# EAGLE design bb8-audio (EAGLE 7.5.0)
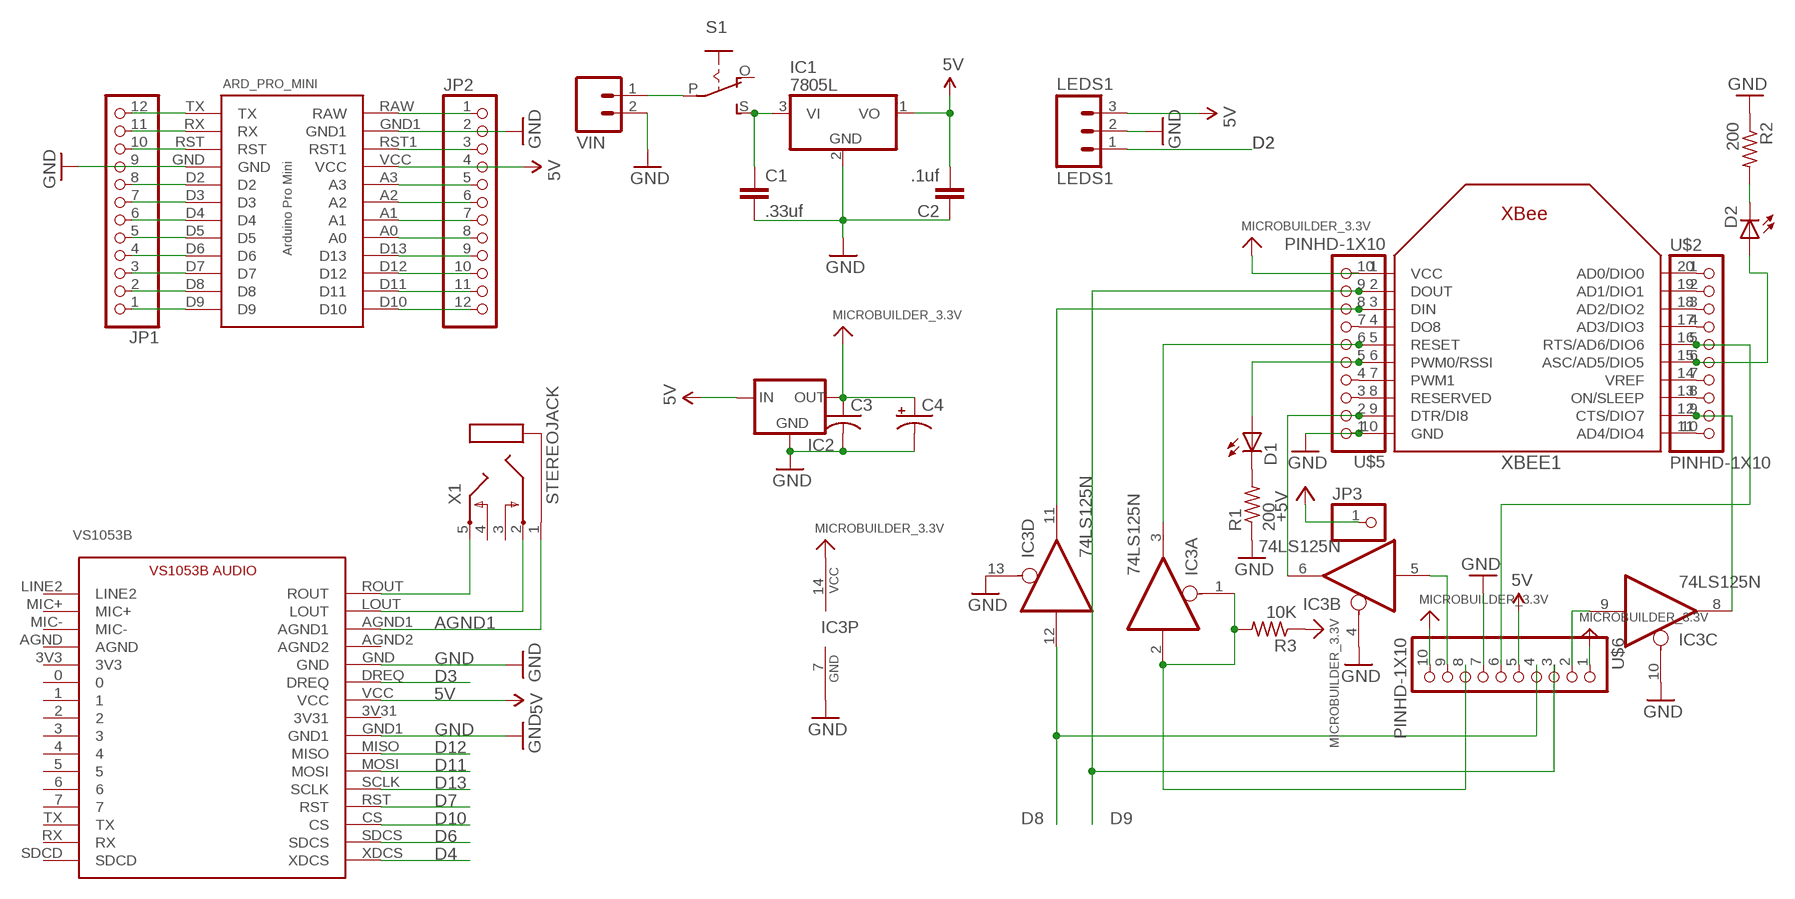
[diagram p0: schematic, sheet 1]

## Parts
ARD_PRO_MINI  ARD_PRO_MINI  [ARD_PRO_MINI]
C1  .33uf  CAPEZ  [CAP-PTH-SMALLEZ]
C2  .1uf  CAPEZ  [CAP-PTH-SMALLEZ]
C3  C-US025-025X050  [C025-025X050]
C4  CPOL-USE2.5-5  [E2,5-5]
D1  LED3MM  [LED3MM]
D2  LED3MM  [LED3MM]
IC1  7805L  [TO92]
IC2  MC1700  [TO92]
IC3  74LS125N  [DIL14]
JP1  PINHD-1X12-CB  [1X12-CB]
JP2  PINHD-1X12-CB  [1X12-CB]
JP3  PINHD-1X1  [1X01]
LEDS1  LEDS1  M03PTH  [1X03]
R1  200  R-US_0207/10  [0207/10]
R2  200  R-US_0207/10  [0207/10]
R3  10K  R-US_0207/10  [0207/10]
S1  EG1218S  [EG1218]
U$2  PINHD-1X10  [1X10-BIG]
U$5  PINHD-1X10  [1X10-BIG]
U$6  PINHD-1X10  [1X10-BIG]
VIN  M02PTH  [1X02]
VS1053B  VS1053B_BREAKOUT  [VS1053_BREAKOUT]
X1  STEREOJACK  [STX3100]
XBEE1  XBEE  [XBEE]

## Nets
3.3V: C3.1 C4.+ IC2.3(OUT) IC3.14(P:VCC) R3.1 U$5.10 U$6.1 U$6.10 XBEE1.1(VCC) ; supply symbol labelled MICROBUILDER_3.3V
5V: ARD_PRO_MINI.VCC C2.2 IC1.1(VO) IC2.2(IN) JP2.4 LEDS1.3 U$6.5 VS1053B.VCC
+5V: JP3.1
A0: ARD_PRO_MINI.A0 JP2.8
A1: ARD_PRO_MINI.A1 JP2.7
A2: ARD_PRO_MINI.A2 JP2.6
A3: ARD_PRO_MINI.A3 JP2.5
AGND1: VS1053B.AGND1 X1.1
D2: ARD_PRO_MINI.D2 JP1.8 LEDS1.1
D3: ARD_PRO_MINI.D3 JP1.7 VS1053B.DREQ
D4: ARD_PRO_MINI.D4 JP1.6 VS1053B.XDCS
D5: ARD_PRO_MINI.D5 JP1.5
D6: ARD_PRO_MINI.D6 JP1.4 VS1053B.SDCS
D7: ARD_PRO_MINI.D7 JP1.3 VS1053B.RST
D8: ARD_PRO_MINI.D8 IC3.12(D:I) JP1.2 U$6.4
D9: ARD_PRO_MINI.D9 JP1.1 U$5.9 U$6.3 XBEE1.2(DOUT)
D10: ARD_PRO_MINI.D10 JP2.12 VS1053B.CS
D11: ARD_PRO_MINI.D11 JP2.11 VS1053B.MOSI
D12: ARD_PRO_MINI.D12 JP2.10 VS1053B.MISO
D13: ARD_PRO_MINI.D13 JP2.9 VS1053B.SCLK
GND: ARD_PRO_MINI.GND ARD_PRO_MINI.GND1 C1.2 C2.1 C3.2 C4.- IC1.2(GND) IC2.1(GND) IC3.4(B:OE) IC3.7(P:GND) IC3.10(C:OE) IC3.13(D:OE) JP1.9 JP2.2 LEDS1.2 R1.1 R2.1 U$5.1 U$6.7 VIN.2 VS1053B.GND VS1053B.GND1 XBEE1.10(GND)
N$2: C1.1 IC1.3(VI) S1.S
N$4: IC3.11(D:O) U$5.8 XBEE1.3(DIN)
N$5: IC3.8(C:O) U$2.9 XBEE1.12(CTS/DIO7)
N$6: U$5.7 XBEE1.4(DO8)
N$7: D1.A U$5.5 XBEE1.6(PWM0/RSSI)
N$8: D1.K(C) R1.2
N$9: D2.K(C) R2.2
N$10: D2.A U$2.6 XBEE1.15(ASC/AD5/DIO5)
N$11: IC3.6(B:O) U$5.2 XBEE1.9(DTR/DI8)
N$12: U$5.3 XBEE1.8(RESERVED)
N$13: U$5.4 XBEE1.7(PWM1)
N$14: U$2.1 XBEE1.20(AD0/DIO0)
N$15: U$2.2 XBEE1.19(AD1/DIO1)
N$16: U$2.3 XBEE1.18(AD2/DIO2)
N$17: U$2.4 XBEE1.17(AD3/DIO3)
N$18: U$2.7 XBEE1.14(VREF)
N$19: U$2.8 XBEE1.13(ON/SLEEP)
N$20: U$2.10 XBEE1.11(AD4/DIO4)
N$21: VS1053B.LOUT X1.2
N$22: IC3.9(C:I) U$6.2
N$23: IC3.3(A:O) U$5.6 XBEE1.5(RESET)
N$24: IC3.5(B:I) U$6.9
N$25: VS1053B.ROUT X1.5
N$26: S1.P VIN.1
RAW: ARD_PRO_MINI.RAW JP2.1
RESET: IC3.1(A:OE) IC3.2(A:I) R3.2 U$6.8
RST: ARD_PRO_MINI.RST ARD_PRO_MINI.RST1 JP1.10 JP2.3
RTS1: U$2.5 U$6.6 XBEE1.16(RTS/AD6/DIO6)
RX: ARD_PRO_MINI.RX JP1.11
TX: ARD_PRO_MINI.TX JP1.12
Unconnected: S1.O VS1053B.0 VS1053B.1 VS1053B.2 VS1053B.3 VS1053B.3V3 VS1053B.3V31 VS1053B.4 VS1053B.5 VS1053B.6 VS1053B.7 VS1053B.AGND VS1053B.AGND2 VS1053B.LINE2 VS1053B.MIC+ VS1053B.MIC- VS1053B.RX VS1053B.SDCD VS1053B.TX X1.3 X1.4

## Library data of the parts
ARD_PRO_MINI = Arduino-Pro-Mini:ARD_PRO_MINI
C1 C2 = SparkFun-Capacitors:CAP: Capacitor Standard 0603 ceramic capacitor, and 0.1" leaded capacitor.
C3 = rcl-ez:C-US: CAPACITOR, American symbol
C4 = rcl-ez:CPOL-US: POLARIZED CAPACITOR, American symbol
D1 D2 = minimidi:LED: LED OSRAM: - CHIPLED LG R971, LG N971, LY N971, LG Q971, LY Q971, LO R971, LY R971 LH N974, LH R974 LS Q976, LO Q976, LY Q976 LO Q996 - Hyper CHIPLED LW Q18S LB Q993, LB Q99A, LB R99A - SideLED LS A670, LO A670, LY A670, LG A670, LP A670 LB A673, LV A673, LT A673, LW A673 LH A674 LY A675 LS A676, LA A676, LO A676, LY A676, LW A676 LS A679, LY A679, LG A679 - Hyper Micro SIDELED® LS Y876, LA Y876, LO Y876, LY Y876 LT Y87S - SmartLED LW L88C, LW L88S LB L89C, LB L89S, LG L890 LS L89K, LO L89K, LY L89K LS L896, LA L896, LO L896, LY L896 - TOPLED LS T670, LO T670, LY T670, LG T670, LP T670 LSG T670, LSP T670, LSY T670, LOP T670, LYG T670 LG T671, LOG T671, LSG T671 LB T673, LV T673, LT T673, LW T673 LH T674 LS T676, LA T676, LO T676, LY T676, LB T676, LH T676, LSB T676, LW T676 LB T67C, LV T67C, LT T67C, LS T67K, LO T67K, LY T67K, LW E67C LS E67B, LA E67B, LO E67B, LY E67B, LB E67C, LV E67C, LT E67C LW T67C LS T679, LY T679, LG T679 LS T770, LO T770, LY T770, LG T770, LP T770 LB T773, LV T773, LT T773, LW T773 LH T774 LS E675, LA E675, LY E675, LS T675 LS T776, LA T776, LO T776, LY T776, LB T776 LHGB T686 LT T68C, LB T68C - Hyper Mini TOPLED® LB M676 - Mini TOPLED Santana® LG M470 LS M47K, LO M47K, LY M47K Source: http://www.osram.convergy.de/
IC1 = linear:78*: Positive VOLTAGE REGULATOR Source: http://cache.national.com/ds/LM/LM78L05.pdf http://www.fairchildsemi.com/ds/LM/LM7805.pdf
IC2 = ulink:MC1700: VOLTAGE REGULATOR
IC3 = 74xx-us:74*125: Quad bus BUFFER, 3-state
JP1 JP2 = adafruit:PINHD-1X12: PIN HEADER
JP3 = digg:PINHD-1X1: PIN HEADER
LEDS1 = SparkFun-Connectors:M03: Header 3 Standard 3-pin 0.1" header. Use with straight break away headers (SKU : PRT-00116), right angle break away headers (PRT-00553), swiss pins (PRT-00743), machine pins (PRT-00117), and female headers (PRT-00115). Molex polarized connector foot print use with SKU : PRT-08232 with associated crimp pins and housings.
R1-R3 = rcl-ez:R-US_: RESISTOR, American symbol
S1 = adafruit:EG1218: SLIDING SWITCH 0.1" spacing through hole, vertical SPDT slide switch http://www.ladyada.net/library/pcb/eaglelibrary.html
U$2 U$5 U$6 = ybox2:PINHD-1X10
VIN = SparkFun-Connectors:M02: Header 2 Standard 2-pin 0.1" header. Use with straight break away headers (SKU : PRT-00116), right angle break away headers (PRT-00553), swiss pins (PRT-00743), machine pins (PRT-00117), and female headers (PRT-00115). Molex polarized connector foot print use with SKU : PRT-08233 with associated crimp pins and housings.
VS1053B = VS1053B_BREAKOUT:VS1053B_BREAKOUT: This is a footprint for a breakout board from Adafruit the VS1053B Audio breakout board. This package will let you easily add this breakout board to your own project for stacking the breakout onto headers for your own project.
X1 = adafruit:STEREOJACK: MIC/HEADPHONE JACK Stereo jack with two switches. Kycon STX3100, CUI SJ1-3555NG and/or 4UCon 05544
XBEE1 = ulink:XBEE

## Board
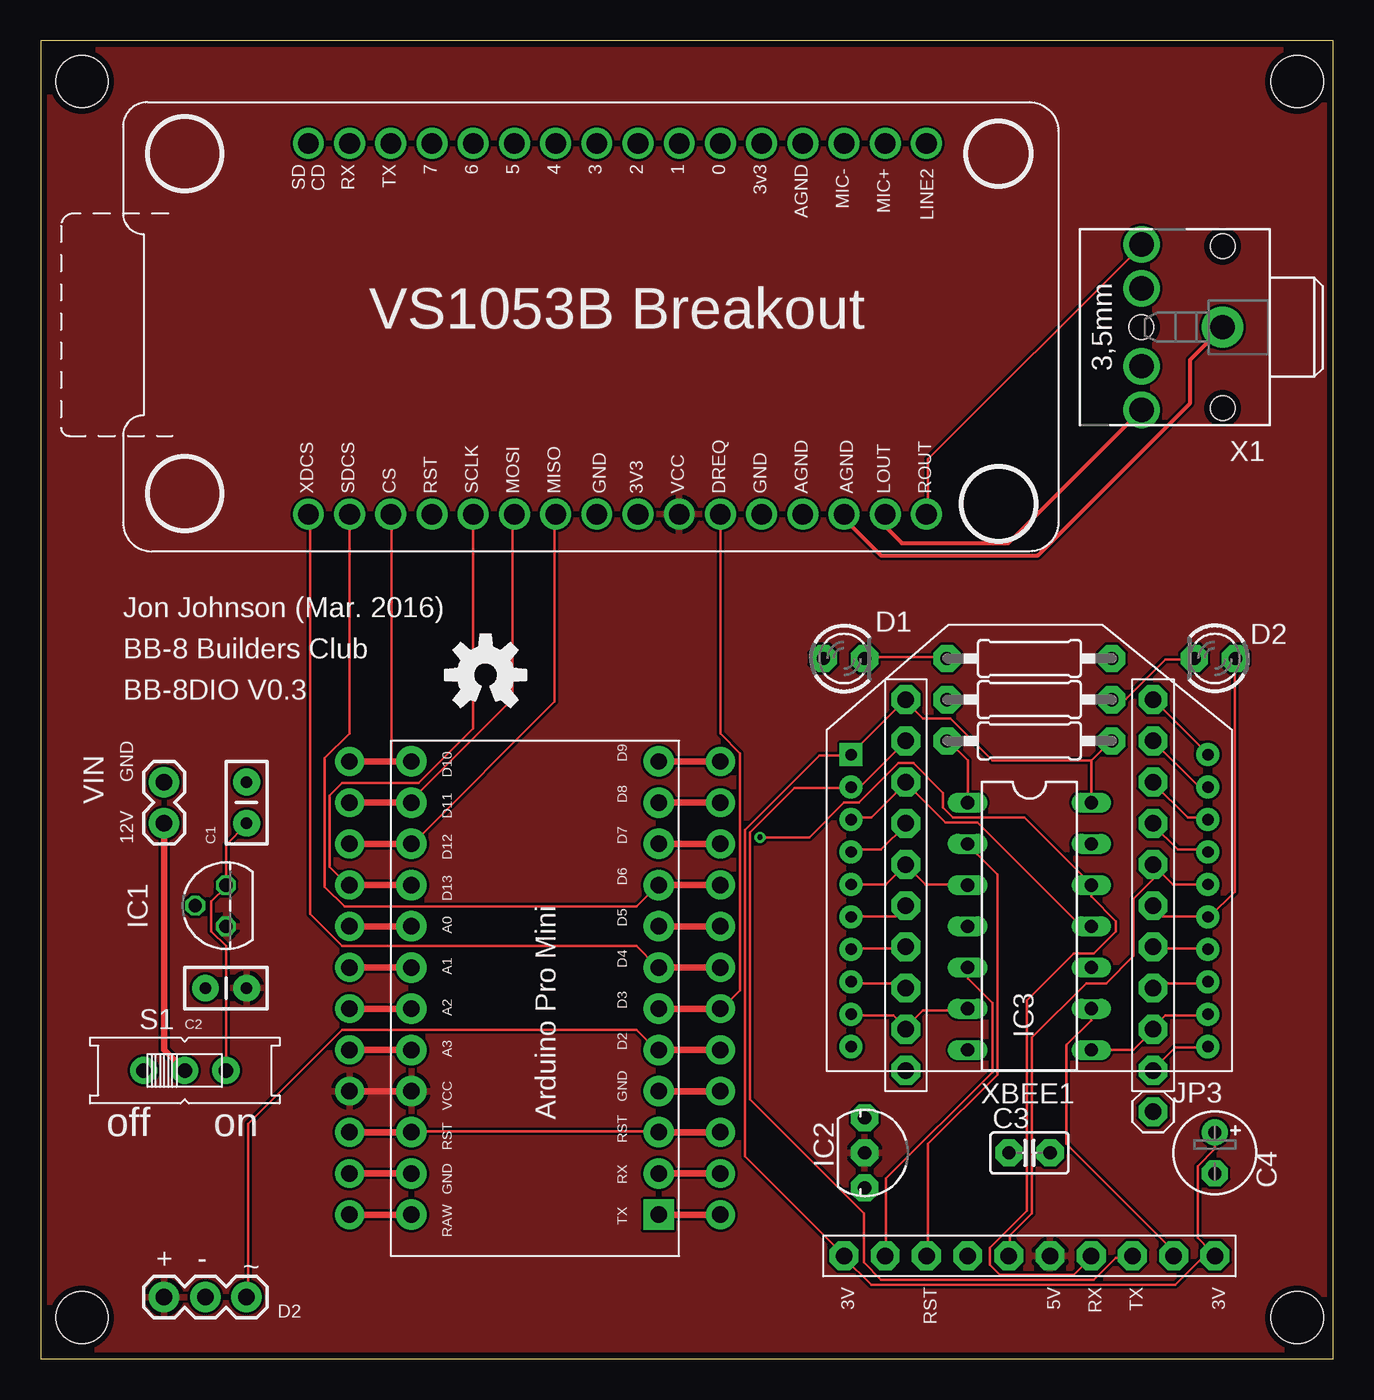
[diagram p1: board, top side]
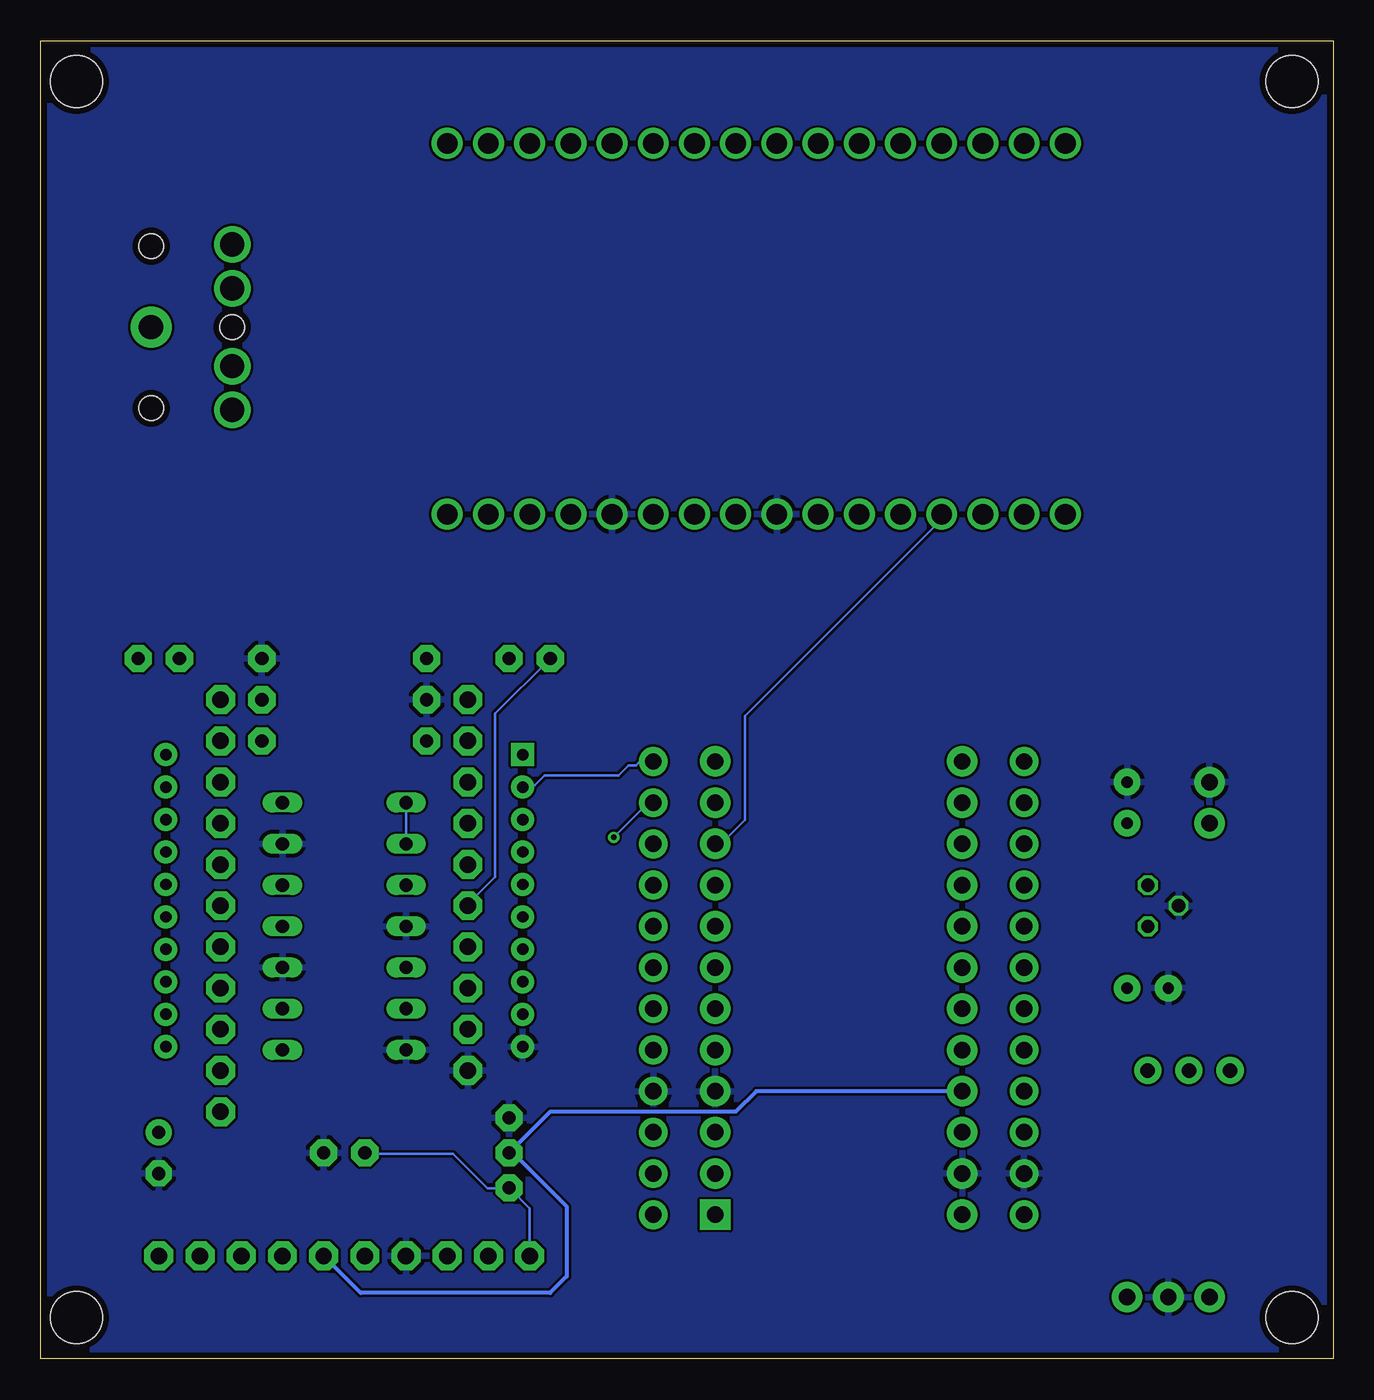
[diagram p2: board, bottom side, seen from below]

Size 79.68 x 81.27 mm. Coordinates in mm from the lower left corner, seen from the top.
Outline: 0,0 79.68,0 79.68,81.27 0,81.27 0,0
Copper layers (1*16): Top 0.0356mm / dielectric 1.5011mm / Bottom 0.0356mm
Design rules "LaenPCBOrder": minimum track width 6mil, minimum drill 13mil, track to track 6mil, track to pad 6mil, pad to pad 6mil, via to via 6mil, smd to smd 6mil, copper to edge 15mil, drill to drill 6mil, minimum pad ring 7mil, minimum via ring 7mil, stop-mask expansion 3mil, vias tented up to drill 0mil, thermal gap 10mil
Holes 3.2 mm at 2.54,78.74 2.54,2.54 77.47,2.54 77.47,78.74

### Footprints (pad centres in the part's own frame; a part is rotated, then mirrored left to right if it is on the bottom)
ARD_PRO_MINI = drill 1.016 pad 1.88: A0 7.62,-5.08; A1 7.62,-2.54; A2 7.62,0; A3 7.62,2.54; D2 -7.62,2.54; D3 -7.62,0; D4 -7.62,-2.54; D5 -7.62,-5.08; D6 -7.62,-7.62; D7 -7.62,-10.16; D8 -7.62,-12.7; D9 -7.62,-15.24; D10 7.62,-15.24; D11 7.62,-12.7; D12 7.62,-10.16; D13 7.62,-7.62; GND -7.62,5.08; GND1 7.62,10.16; RAW 7.62,12.7; RST -7.62,7.62; RST1 7.62,7.62; RX -7.62,10.16; VCC 7.62,5.08 | drill 1.016 pad 1.88 square: TX -7.62,12.7
CAP-PTH-SMALLEZ = drill 0.7 pad 1.651: 1 0,0; 2 2.54,0
C025-025X050 = drill 0.813 pad 1.676 octagon: 1 -1.27,0; 2 1.27,0
E2,5-5 = drill 0.813 pad 1.6: + -1.27,0 | drill 0.813 pad 1.6 octagon: - 1.27,0
LED3MM = drill 0.813 pad 1.676 octagon: A -1.27,0; K 1.27,0
TO92 = drill 0.813 octagon: 1 -1.27,0; 2 0,1.905; 3 1.27,0
TO92' = drill 0.813 pad 1.676 octagon: 1 -2.159,0; 2 0,0; 3 2.159,0
DIL14 = drill 0.813 long: 1 -7.62,-3.81; 2 -5.08,-3.81; 3 -2.54,-3.81; 4 0,-3.81; 5 2.54,-3.81; 6 5.08,-3.81; 7 7.62,-3.81; 8 7.62,3.81; 9 5.08,3.81; 10 2.54,3.81; 11 0,3.81; 12 -2.54,3.81; 13 -5.08,3.81; 14 -7.62,3.81
1X12-CB = drill 1.016 pad 1.778: 1 -13.97,0; 2 -11.43,0; 3 -8.89,0; 4 -6.35,0; 5 -3.81,0; 6 -1.27,0; 7 1.27,0; 8 3.81,0; 9 6.35,0; 10 8.89,0; 11 11.43,0; 12 13.97,0
1X01 = drill 1.016 pad 1.778 octagon: 1 0,0
1X03 = drill 1.016 pad 1.88: 1 0,0; 2 2.54,0; 3 5.08,0
0207/10 = drill 0.813 pad 1.676 octagon: 1 -5.08,0; 2 5.08,0
EG1218 = drill 0.9 pad 1.676: O -2.54,0; P 0,0; S 2.54,0
1X10-BIG = drill 1.016 pad 1.778 octagon: 1 -11.43,0; 2 -8.89,0; 3 -6.35,0; 4 -3.81,0; 5 -1.27,0; 6 1.27,0; 7 3.81,0; 8 6.35,0; 9 8.89,0; 10 11.43,0
1X02 = drill 1.016 pad 1.88: 1 0,0; 2 2.54,0
VS1053_BREAKOUT = drill 1.27 pad 1.88: 0 2.54,36.83; 1 2.54,34.29; 2 2.54,31.75; 3 2.54,29.21; 3V3 2.54,39.37; 3V31 25.4,31.75; 4 2.54,26.67; 5 2.54,24.13; 6 2.54,21.59; 7 2.54,19.05; AGND 2.54,41.91; AGND1 25.4,44.45; AGND2 25.4,41.91; CS 25.4,16.51; DREQ 25.4,36.83; GND 25.4,39.37; GND1 25.4,29.21; LINE2 2.54,49.53; LOUT 25.4,46.99; MIC+ 2.54,46.99; MIC- 2.54,44.45; MISO 25.4,26.67; MOSI 25.4,24.13; ROUT 25.4,49.53; RST 25.4,19.05; RX 2.54,13.97; SCLK 25.4,21.59; SDCD 2.54,11.43; SDCS 25.4,13.97; TX 2.54,16.51; VCC 25.4,34.29; XDCS 25.4,11.43
STX3100 = drill 1.5 pad 2.54: 1 2.7,-0.1 | drill 1.5: 2 7.7,5; 3 7.7,2.3; 4 7.7,-2.5; 5 7.7,-5.2 | hole 1.5: 2.7,4.9; 2.7,-5.1; 7.7,-0.1
XBEE = drill 0.7 pad 1.422 square: 1 -11,5.5 | drill 0.7 pad 1.422: 2 -11,3.5; 3 -11,1.5; 4 -11,-0.5; 5 -11,-2.5; 6 -11,-4.5; 7 -11,-6.5; 8 -11,-8.5; 9 -11,-10.5; 10 -11,-12.5; 11 11,-12.5; 12 11,-10.5; 13 11,-8.5; 14 11,-6.5; 15 11,-4.5; 16 11,-2.5; 17 11,-0.5; 18 11,1.5; 19 11,3.5; 20 11,5.5

### Placement (x,y rotation side)
ARD_PRO_MINI  30.48,21.59 180 top
C1  12.7,33.02 90 top
C2  10.16,22.86 0 top
C3  60.96,12.7 0 top
C4  72.39,12.7 270 top
D1  49.53,43.18 0 top
D2  72.39,43.18 180 top
IC1  11.43,27.94 90 top
IC2  [TO92']  50.8,12.7 270 top
IC3  60.96,26.67 270 top
JP1  41.91,22.86 270 top
JP2  19.05,22.86 90 top
JP3  68.58,15.24 0 top
LEDS1  12.7,3.81 180 top
R1  60.96,43.18 180 top
R2  60.96,40.64 0 top
R3  60.96,38.1 180 top
S1  8.89,17.78 0 top
U$2  68.58,29.21 270 top
U$3  [OSHW-LOGO-M]  27.43,42.16 0 top
U$5  53.34,29.21 90 top
U$6  60.96,6.35 180 top
VIN  7.62,33.02 90 top
VS1053B  5.08,77.47 270 top
X1  75.56,63.5 180 top
XBEE1  60.96,31.75 0 top

### Tracks (layer width: path | path; a pad name or v marks a point on that pad's centre or on a via)
3.3V
  Top 0.152: 64.77,36.88 IC3.14 | 64.77,36.88 65.99,38.1 R3.1 | 64.77,36.88 58.67,36.88 56.08,39.47 54.41,39.47 53.34,40.54 U$5.10 53.34,40.69 49.99,37.34 XBEE1.1 49.84,37.19 48.01,37.19 43.43,32.61 43.43,12.5 49.53,6.4 U$6.10 49.53,6.25 51.21,4.57 69.95,4.57 72.08,6.71 | 72.08,6.71 72.39,6.4 U$6.1 72.08,6.71 | 72.08,6.71 71.32,7.47 71.32,11.89 72.39,12.95 72.39,13.87 C4.+
  Bottom 0.152: U$6.10 49.53,6.4 49.53,9.3 50.75,10.52 IC2.3 50.9,10.52 52.12,10.52 54.25,12.65 59.59,12.65 C3.1
5V
  Top 0.406: JP2.4 ARD_PRO_MINI.VCC
  Bottom 0.254: ARD_PRO_MINI.VCC 35.56,16.51 36.83,15.24 48.26,15.24 IC2.2 50.55,12.7 47.24,9.4 47.24,5.08 48.26,4.06 59.94,4.06 U$6.5
  pour Top: 0,81.28 0,0 79.76,0 79.76,81.28
A0
  Top 0.406: JP2.8 ARD_PRO_MINI.A0
A1
  Top 0.406: JP2.7 ARD_PRO_MINI.A1
A2
  Top 0.406: JP2.6 ARD_PRO_MINI.A2
A3
  Top 0.406: JP2.5 ARD_PRO_MINI.A3
AGND1
  Top 0.254: VS1053B.AGND1 49.53,51.82 51.82,49.53 61.47,49.53 70.87,58.93 70.87,61.6 X1.1
D2
  Top 0.152: LEDS1.1 12.8,3.81 12.8,14.48 18.59,20.27 36.73,20.27 37.95,19.05 ARD_PRO_MINI.D2
  Top 0.406: ARD_PRO_MINI.D2 JP1.8
D3
  Top 0.152: VS1053B.DREQ 41.91,51.97 41.91,38.56 43.13,37.34 43.13,22.71 42.06,21.64 JP1.7
  Top 0.406: ARD_PRO_MINI.D3 JP1.7
D4
  Top 0.152: VS1053B.XDCS 16.61,51.97 16.61,27.43 18.59,25.45 36.73,25.45 37.95,24.23 ARD_PRO_MINI.D4
  Top 0.406: ARD_PRO_MINI.D4 JP1.6
D5
  Top 0.406: ARD_PRO_MINI.D5 JP1.5
D6
  Top 0.152: VS1053B.SDCS 19.05,51.97 19.05,38.56 17.53,37.03 17.53,29.11 18.75,27.89 36.73,27.89 37.95,29.11 ARD_PRO_MINI.D6
  Top 0.406: ARD_PRO_MINI.D6 JP1.4
D7
  Top 0.406: ARD_PRO_MINI.D7 JP1.3
  Bottom 0.152: VS1053B.RST 24.23,51.97 24.23,51.66 36.27,39.62 36.27,33.22 37.64,31.85 38.1,31.85 ARD_PRO_MINI.D7
D8  (via drill 0.33)
  Top 0.152: U$6.4 64.77,6.25 63.7,5.18 59.13,5.18 58.52,5.79 58.52,6.86 60.81,9.14 60.81,22.1 63.7,24.99 64.92,24.99 66.29,26.36 66.29,26.98 64.77,28.5 64.77,29.11 IC3.12 64.77,29.26 60.66,33.38 56.24,33.38 55.63,33.98 55.63,34.9 53.8,36.73 52.88,36.73 50.44,34.29 49.53,34.29 47.4,32.16 v44.35,32.16
  Top 0.406: ARD_PRO_MINI.D8 JP1.2
  Bottom 0.152: JP1.2 42.22,34.29 v44.35,32.16
D9
  Top 0.152: U$5.9 50.6,35.36 49.99,35.36 XBEE1.2 49.84,35.2 46.48,35.2 43.74,32.46 43.74,16 50.75,8.99 50.75,5.94 51.82,4.88 64.92,4.88 66.29,6.25 67.21,6.25 U$6.3
  Top 0.406: ARD_PRO_MINI.D9 JP1.1
  Bottom 0.152: JP1.1 41.91,36.73 42.82,36.73 42.98,36.58 43.43,36.58 44.04,35.97 48.62,35.97 49.23,35.36 49.84,35.36 XBEE1.2
D10
  Top 0.152: VS1053B.CS 21.64,51.97 21.64,36.88 21.64,36.83
  Top 0.406: JP2.12 21.64,36.83 ARD_PRO_MINI.D10
D11
  Top 0.152: VS1053B.MOSI 29.11,51.97 29.11,40.69 22.86,34.44 ARD_PRO_MINI.D11
  Top 0.406: JP2.11 ARD_PRO_MINI.D11
D12
  Top 0.152: VS1053B.MISO 31.7,51.97 31.7,40.54 23.01,31.85 ARD_PRO_MINI.D12
  Top 0.406: JP2.10 ARD_PRO_MINI.D12
D13
  Top 0.152: VS1053B.SCLK 26.67,51.97 26.67,38.86 23.32,35.51 18.59,35.51 17.83,34.75 17.83,30.33 18.9,29.26 JP2.9
  Top 0.406: JP2.9 ARD_PRO_MINI.D13
GND
  Top 0.406: JP2.2 ARD_PRO_MINI.GND1 | ARD_PRO_MINI.GND JP1.9
  pour Bottom: 0,81.28 79.76,81.53 79.76,0.25 0,0
N$2
  Top 0.152: C1.1 12.65,32.92 11.43,31.7 11.43,29.26 IC1.3 11.43,29.11 10.52,28.19 10.52,26.36 11.43,25.45 11.43,17.83 S1.S
N$4
  Top 0.152: IC3.11 64.16,26.67 57.76,33.07 55.78,33.07 53.34,35.51 | 53.34,35.51 U$5.8 53.34,35.51 | 53.34,35.51 51.21,33.38 49.99,33.38 XBEE1.3
N$5
  Top 0.152: IC3.8 67.36,19.05 68.58,20.27 U$2.9 68.58,20.42 69.34,21.18 71.93,21.18 XBEE1.12
N$6
  Top 0.152: XBEE1.4 49.99,31.39 51.82,31.39 53.34,32.92 U$5.7
N$7
  Top 0.152: XBEE1.6 49.99,27.28 52.73,27.28 53.34,27.89 U$5.5
  Bottom 0.152: D1.A 48.31,43.13 51.66,39.78 51.66,29.72 53.34,28.04 U$5.5
N$8
  Top 0.152: D1.K 50.9,43.28 55.78,43.28 R1.2
N$9
  Top 0.152: R2.2 66.14,40.69 66.9,40.69 69.34,43.13 71.02,43.13 D2.K
N$10
  Top 0.152: U$2.6 68.58,27.89 69.19,27.28 71.93,27.28 XBEE1.15 72.08,27.28 73.61,28.8 73.61,43.13 D2.A
N$11
  Top 0.152: 53.34,20.42 54.41,21.49 57.15,21.49 IC3.6 | 53.34,20.42 U$5.2 53.34,20.42 | 53.34,20.42 52.58,21.18 49.99,21.18 XBEE1.9
N$12
  Top 0.152: U$5.3 53.03,23.16 49.99,23.16 XBEE1.8
N$13
  Top 0.152: XBEE1.7 49.99,25.3 53.34,25.3 U$5.4
N$14
  Top 0.152: XBEE1.20 71.93,37.34 68.58,40.69 U$2.1
N$15
  Top 0.152: U$2.2 71.32,35.36 71.93,35.36 XBEE1.19
N$16
  Top 0.152: XBEE1.18 71.93,33.38 70.71,33.38 68.58,35.51 U$2.3
N$17
  Top 0.152: XBEE1.17 71.93,31.39 70.1,31.39 68.58,32.92 U$2.4
N$18
  Top 0.152: XBEE1.14 71.93,25.3 68.58,25.3 U$2.7
N$19
  Top 0.152: U$2.8 68.89,23.16 71.93,23.16 XBEE1.13
N$20
  Top 0.152: XBEE1.11 71.93,19.2 69.95,19.2 68.58,17.83 U$2.10
N$21
  Top 0.254: VS1053B.LOUT 52.07,51.31 53.09,50.29 59.66,50.29 X1.2
N$22
  Top 0.152: IC3.9 64.77,21.49 64.77,20.88 63.25,19.36 63.25,13.26 69.8,6.71 69.8,6.4 U$6.2
N$23
  Top 0.152: IC3.3 57.15,29.26 54.56,29.26 U$5.6 52.12,29.26 49.99,29.26 XBEE1.5
N$24
  Top 0.152: IC3.5 57.15,24.08 57.15,23.47 58.67,21.95 58.67,17.68 52.12,11.12 52.12,6.4 U$6.9
N$25
  Top 0.152: VS1053B.ROUT 54.71,52.12 54.71,55.47 67.82,68.58 X1.5
N$26
  Top 0.406: VIN.1 7.62,19.05 S1.P
RAW
  Top 0.406: JP2.1 ARD_PRO_MINI.RAW
RESET
  Top 0.152: IC3.1 57.15,36.88 55.93,38.1 R3.2 | U$6.8 54.71,6.4 54.71,13.26 58.98,17.53 58.98,29.87 57.15,31.7 IC3.2
  Bottom 0.152: IC3.1 57.15,31.85 IC3.2
RST
  Top 0.152: ARD_PRO_MINI.RST1 23.01,14.02 37.95,14.02 ARD_PRO_MINI.RST
  Top 0.406: JP2.3 ARD_PRO_MINI.RST1 | ARD_PRO_MINI.RST JP1.10
RTS1
  Top 0.152: 69.04,30.02 U$2.5 69.04,30.02 | 69.04,30.02 69.8,29.26 71.93,29.26 XBEE1.16 | 69.04,30.02 67.36,28.35 67.36,24.84 65.68,23.16 64.47,23.16 61.11,19.81 61.11,8.99 59.74,7.62 59.74,6.4 U$6.6
RX
  Top 0.406: ARD_PRO_MINI.RX JP1.11
TX
  Top 0.406: ARD_PRO_MINI.TX JP1.12

### Text on the board
tPlace: off | on
_tsilk: Jon Johnson (Mar. 2016) | BB-8 Builders Club | BB-8DIO V0.3 | GND | 12V | + | - | ~ | 3V | RST | 5V | RX | TX | 3V | D2